# EAGLE design Project Canary V4.3 (EAGLE 8.4.1)
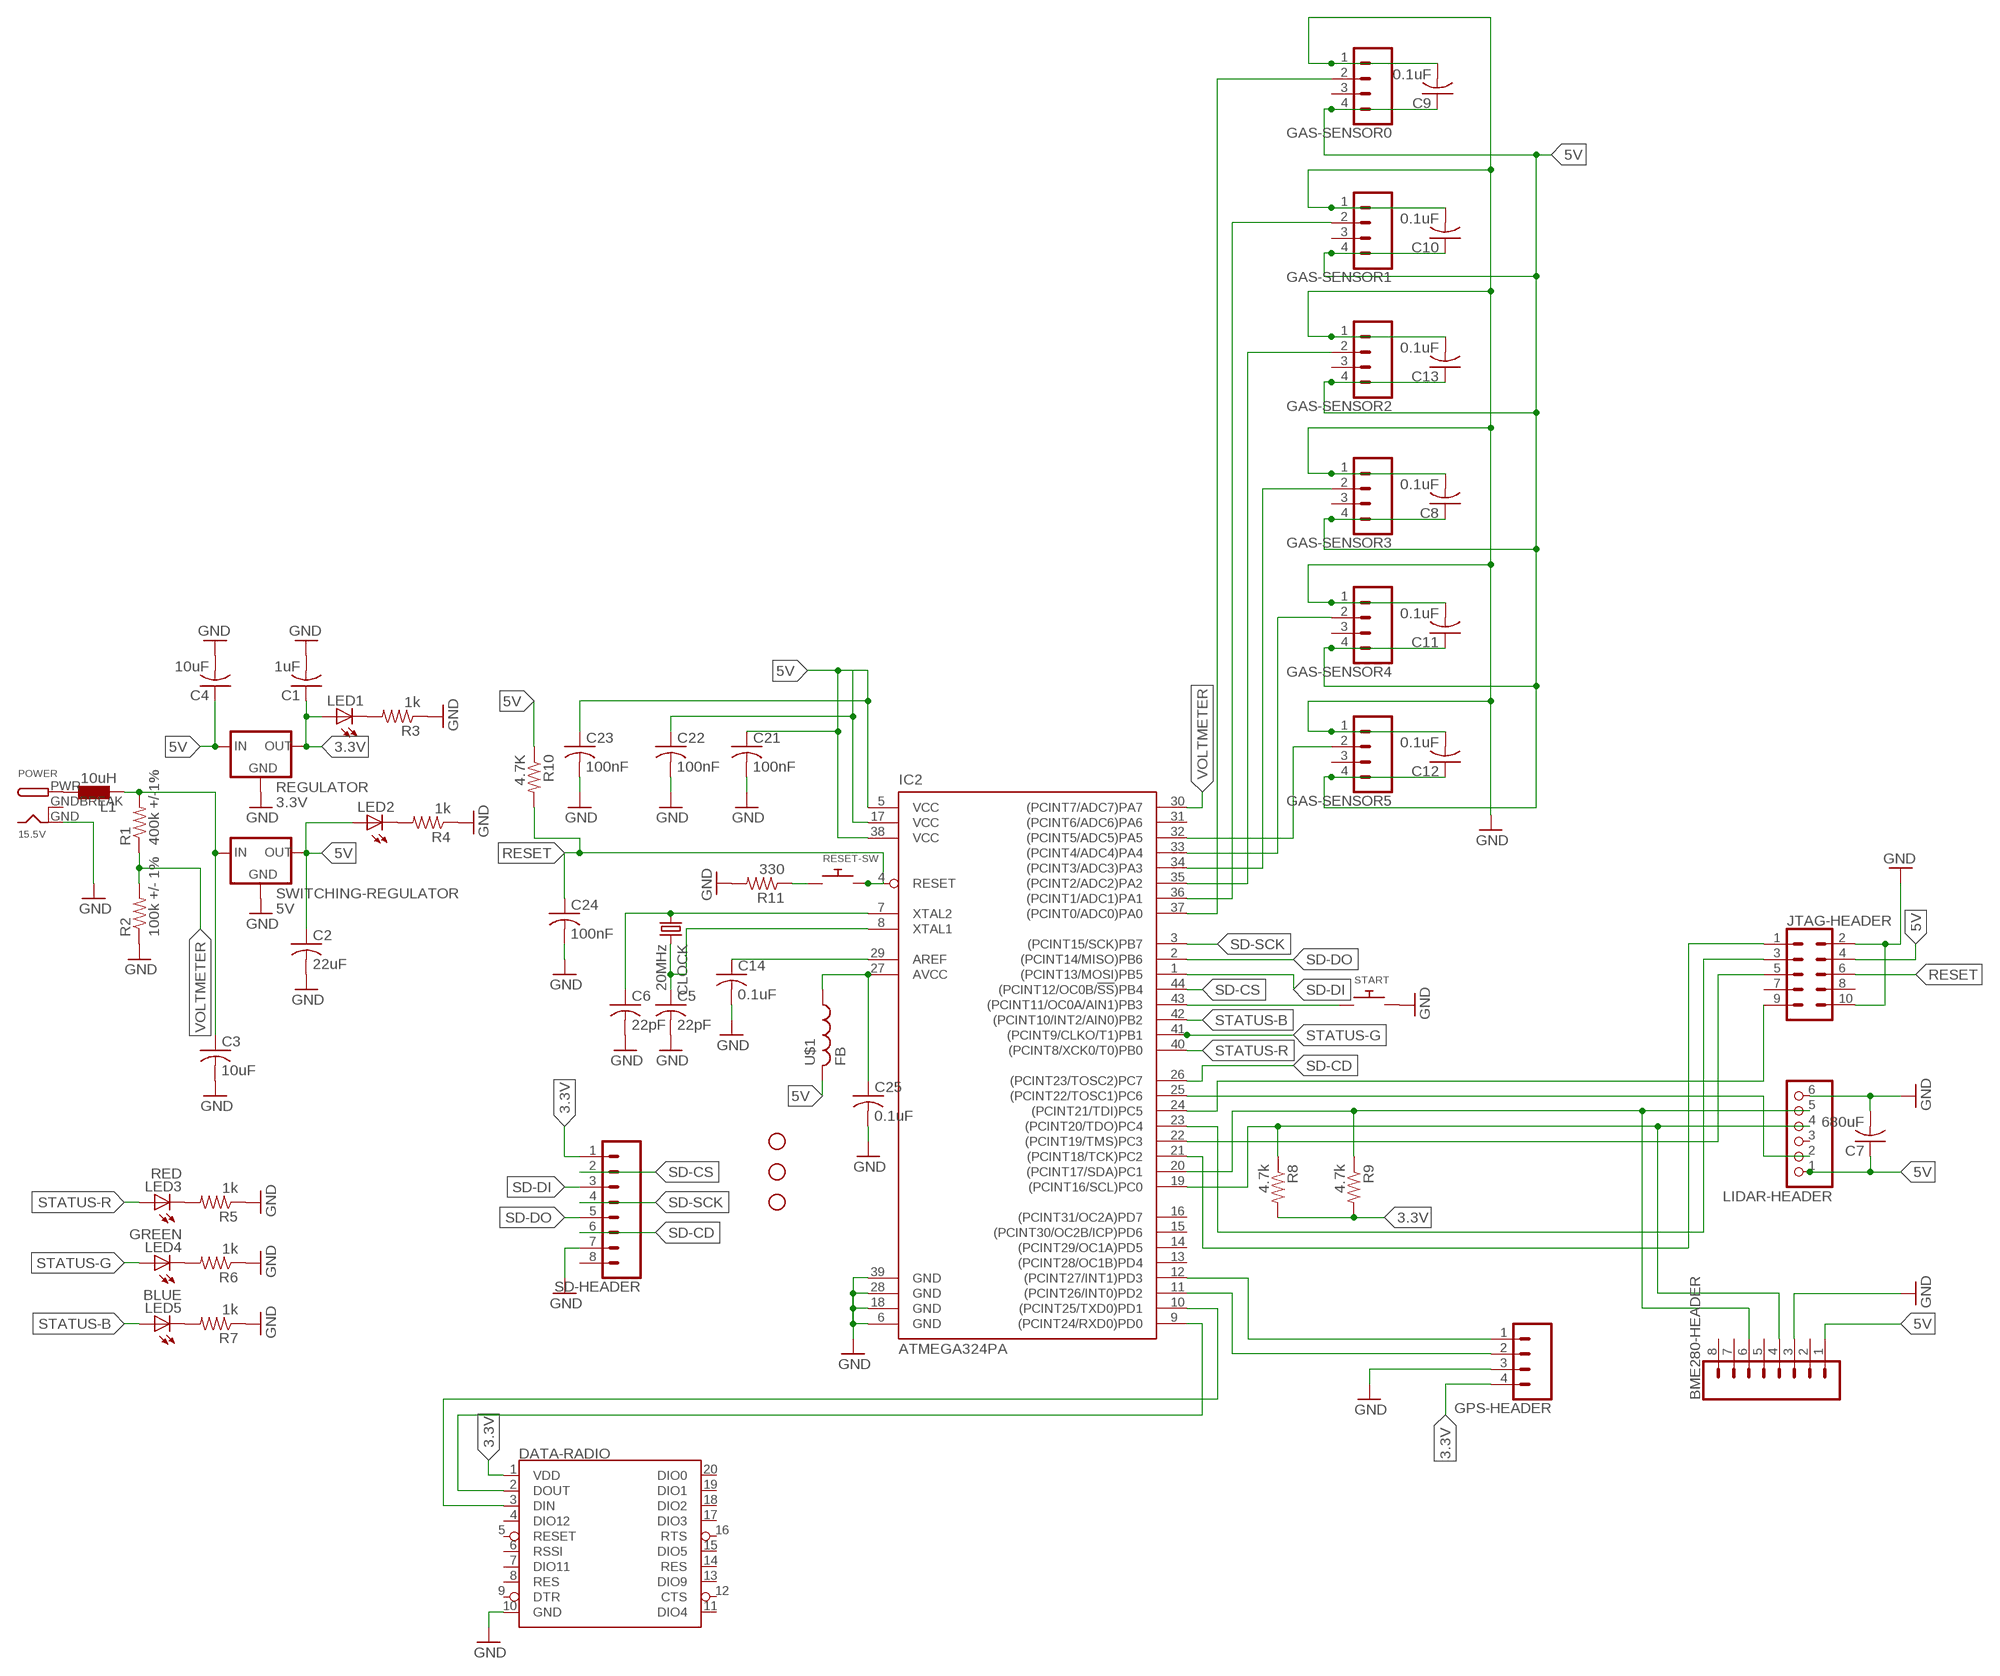
[diagram p0: schematic, sheet 1]

## Parts
BME280-HEADER  CONN_08"  [1X08]
C1  1uF  C-USC0805  [C0805]
C2  22uF  C-USC0603  [C0603]
C3  10uF  C-USC0805  [C0805]
C4  10uF  C-USC0603  [C0603]
C5  22pF  C-USC0603  [C0603]
C6  22pF  C-USC0603  [C0603]
C7  680uF  C-USC0603  [C0603]
C8  0.1uF  C-USC0603  [C0603]
C9  0.1uF  C-USC0603  [C0603]
C10  0.1uF  C-USC0603  [C0603]
C11  0.1uF  C-USC0603  [C0603]
C12  0.1uF  C-USC0603  [C0603]
C13  0.1uF  C-USC0603  [C0603]
C14  0.1uF  C-USC0603  [C0603]
C21  100nF  C-USC0603  [C0603]
C22  100nF  C-USC0603  [C0603]
C23  100nF  C-USC0603  [C0603]
C24  100nF  C-USC0805  [C0805]
C25  0.1uF  C-USC0603  [C0603]
CLOCK  20MHz  CRYSTAL68SMX  [86SMX]
DATA-RADIO  XBEE  [XBEE]
GAS-SENSOR0  CONN_04  [1X04]
GAS-SENSOR1  CONN_04  [1X04]
GAS-SENSOR2  CONN_04  [1X04]
GAS-SENSOR3  CONN_04  [1X04]
GAS-SENSOR4  CONN_04  [1X04]
GAS-SENSOR5  CONN_04  [1X04]
GPS-HEADER  CONN_04  [1X04]
IC2  ATMEGA324PA  ATMEGA644A  [TQFP44]
JTAG-HEADER  CONN_05X2PTH  [2X5]
L1  10uH  L  [L1812]
LED1  LEDCHIP-LED0805  [CHIP-LED0805]
LED2  LEDCHIP-LED0805  [CHIP-LED0805]
LED3  RED  LEDCHIP-LED0805  [CHIP-LED0805]
LED4  GREEN  LEDCHIP-LED0805  [CHIP-LED0805]
LED5  BLUE  LEDCHIP-LED0805  [CHIP-LED0805]
LIDAR-HEADER  PINHD-1X6  [1X06]
MOUNT-HOLE1  STAND-OFF  [STAND-OFF]
MOUNT-HOLE2  STAND-OFF  [STAND-OFF]
MOUNT-HOLE3  STAND-OFF  [STAND-OFF]
POWER  15.5V  DCBARRELPTH  [DCJACK_2MM_PTH]
R1  400k +/-1%  R-US_M0805  [M0805]
R2  100k +/- 1%  R-US_M0805  [M0805]
R3  1k  R-US_M0805  [M0805]
R4  1k  R-US_M0805  [M0805]
R5  1k  R-US_M0805  [M0805]
R6  1k  R-US_M0805  [M0805]
R7  1k  R-US_M0805  [M0805]
R8  4.7k  R-US_M0805  [M0805]
R9  4.7k  R-US_M0805  [M0805]
R10  4.7K  R-US_M0805  [M0805]
R11  330  R-US_M0805  [M0805]
REGULATOR  3.3V  V_REG_78XXSINK  [TO220-IGO]
RESET-SW  SWITCH_PUSHBUTTONSOFTTOUCHSMD_SJ  [PUSHBUTTON_SMD_SJ]
SD-HEADER  CONN_08"  [1X08]
START  SWITCH_PUSHBUTTONSOFTTOUCHSMD_SJ  [PUSHBUTTON_SMD_SJ]
SWITCHING-REGULATOR  5V  V_REG_78XXSINK  [TO220-IGO]
U$1  FB  [FB]

## Nets
3.3V: C1.1 DATA-RADIO.1(VDD) GPS-HEADER.4 LED1.A R8.2 R9.2 REGULATOR.OUT SD-HEADER.1
5V: BME280-HEADER.1 C2.1 C4.1 C7.1 C8.1 C9.1 C10.1 C11.1 C12.1 C13.1 C21.1 C22.1 C23.1 C25.1 GAS-SENSOR0.4 GAS-SENSOR1.4 GAS-SENSOR2.4 GAS-SENSOR3.4 GAS-SENSOR4.4 GAS-SENSOR5.4 IC2.5(VCC) IC2.17(VCC) IC2.27(AVCC) IC2.38(VCC) JTAG-HEADER.4 LED2.A LIDAR-HEADER.1 REGULATOR.IN SWITCHING-REGULATOR.OUT U$1.P$1
GND: BME280-HEADER.3 C1.2 C2.2 C3.2 C4.2 C5.2 C6.2 C7.2 C8.2 C9.2 C10.2 C11.2 C12.2 C13.2 C14.2 C21.2 C22.2 C23.2 C24.2 C25.2 DATA-RADIO.10(GND) GAS-SENSOR0.1 GAS-SENSOR1.1 GAS-SENSOR2.1 GAS-SENSOR3.1 GAS-SENSOR4.1 GAS-SENSOR5.1 GPS-HEADER.3 IC2.6(GND) IC2.18(GND) IC2.28(GND) IC2.39(GND) JTAG-HEADER.2 JTAG-HEADER.10 LIDAR-HEADER.6 POWER.GND R2.1 R3.1 R4.1 R5.1 R6.1 R7.1 R11.2 REGULATOR.GND SD-HEADER.7 START.P$2 SWITCHING-REGULATOR.GND
N$1: C3.1 L1.2 R1.2 SWITCHING-REGULATOR.IN
N$2: LED1.C R3.2
N$3: LED2.C R4.2
N$4: LED3.C R5.2
N$5: LED4.C R6.2
N$6: LED5.C R7.2
N$7: IC2.43((PCINT11/OC0A/AIN1)PB3) START.P$1
N$8: C6.1 CLOCK.1 IC2.7(XTAL2)
N$9: U$1.P$2
N$10: GPS-HEADER.1 IC2.12((PCINT27/INT1)PD3)
N$11: GPS-HEADER.2 IC2.11((PCINT26/INT0)PD2)
N$12: GAS-SENSOR0.2 IC2.37((PCINT0/ADC0)PA0)
N$13: IC2.25((PCINT22/TOSC1)PC6) LIDAR-HEADER.2
N$14: IC2.24((PCINT21/TDI)PC5) JTAG-HEADER.9
N$15: C14.1 IC2.29(AREF)
N$16: GAS-SENSOR1.2 IC2.36((PCINT1/ADC1)PA1)
N$17: GAS-SENSOR2.2 IC2.35((PCINT2/ADC2)PA2)
N$18: GAS-SENSOR3.2 IC2.34((PCINT3/ADC3)PA3)
N$19: GAS-SENSOR4.2 IC2.33((PCINT4/ADC4)PA4)
N$20: GAS-SENSOR5.2 IC2.32((PCINT5/ADC5)PA5)
N$21: BME280-HEADER.4 IC2.19((PCINT16/SCL)PC0) LIDAR-HEADER.4 R8.1
N$22: L1.1 POWER.PWR
N$23: IC2.23((PCINT20/TDO)PC4) JTAG-HEADER.3
N$24: BME280-HEADER.6 IC2.20((PCINT17/SDA)PC1) LIDAR-HEADER.5 R9.1
N$25: IC2.22((PCINT19/TMS)PC3) JTAG-HEADER.5
N$26: DATA-RADIO.3(DIN) IC2.10((PCINT25/TXD0)PD1)
N$27: DATA-RADIO.2(DOUT) IC2.9((PCINT24/RXD0)PD0)
N$28: IC2.21((PCINT18/TCK)PC2) JTAG-HEADER.1
N$30: R11.1 RESET-SW.P$1
N$31: R10.1
N$32: C5.1 CLOCK.4 IC2.8(XTAL1)
RESET: C24.1 IC2.4(RESET) JTAG-HEADER.6 R10.2 RESET-SW.P$2
SD-CD: IC2.26((PCINT23/TOSC2)PC7) SD-HEADER.6
SD-CS: IC2.44((PCINT12/OC0B/!SS!)PB4) SD-HEADER.2
SD-DI: IC2.1((PCINT13/MOSI)PB5) SD-HEADER.3
SD-DO: IC2.2((PCINT14/MISO)PB6) SD-HEADER.5
SD-SCK: IC2.3((PCINT15/SCK)PB7) SD-HEADER.4
STATUS-B: IC2.42((PCINT10/INT2/AIN0)PB2) LED5.A
STATUS-G: IC2.41((PCINT9/CLKO/T1)PB1) LED4.A
STATUS-R: IC2.40((PCINT8/XCK0/T0)PB0) LED3.A
VOLTMETER: IC2.30((PCINT7/ADC7)PA7) R1.1 R2.2
Unconnected: BME280-HEADER.2 BME280-HEADER.5 BME280-HEADER.7 BME280-HEADER.8 DATA-RADIO.4(DIO12) DATA-RADIO.5(RESET) DATA-RADIO.6(RSSI) DATA-RADIO.7(DIO11) DATA-RADIO.8(RES) DATA-RADIO.9(DTR) DATA-RADIO.11(DIO4) DATA-RADIO.12(CTS) DATA-RADIO.13(DIO9) DATA-RADIO.14(RES) DATA-RADIO.15(DIO5) DATA-RADIO.16(RTS) DATA-RADIO.17(DIO3) DATA-RADIO.18(DIO2) DATA-RADIO.19(DIO1) DATA-RADIO.20(DIO0) GAS-SENSOR0.3 GAS-SENSOR1.3 GAS-SENSOR2.3 GAS-SENSOR3.3 GAS-SENSOR4.3 GAS-SENSOR5.3 IC2.13((PCINT28/OC1B)PD4) IC2.14((PCINT29/OC1A)PD5) IC2.15((PCINT30/OC2B/ICP)PD6) IC2.16((PCINT31/OC2A)PD7) IC2.31((PCINT6/ADC6)PA6) JTAG-HEADER.7 JTAG-HEADER.8 LIDAR-HEADER.3 SD-HEADER.8

## Power pins joined to a net without a drawn wire
GNDBREAK: POWER.GNDBREAK

## Library data of the parts
BME280-HEADER SD-HEADER = SparkFun-Connectors:CONN_08: Multi connection point. Often used as Generic Header-pin footprint for 0.1 inch spaced/style header connections On any of the 0.1 inch spaced packages, you can populate with these: Break Away Headers - Straight <https://www.sparkfun.com/products/116> (PRT-00116) Break Away Male Headers - Right Angle <https://www.sparkfun.com/products/553> (PRT-00553) Female Headers <https://www.sparkfun.com/products/115> (PRT-00115) Break Away Headers - Machine Pin <https://www.sparkfun.com/products/117> (PRT-00117) Break Away Female Headers - Swiss Machine Pin <https://www.sparkfun.com/products/743> (PRT-00743) Arduino Stackable Header - 8 Pin <https://www.sparkfun.com/products/9279> (PRT-09279) For SCREWTERMINALS and SPRING TERMINALS visit here: Screw Terimnals on SparkFun.com <https://www.sparkfun.com/search/results?term=Screw+Terminals> (5mm/3.5mm/2.54mm spacing) This device is also useful as a general connection point to wire up your design to another part of your project. Our various solder wires solder well into these plated through hole pads. Hook-Up Wire - Assortment (Stranded, 22 AWG) <https://www.sparkfun.com/products/11375> (PRT-11375) Hook-Up Wire - Assortment (Solid Core, 22 AWG) <https://www.sparkfun.com/products/11367> (PRT-11367) View the entire wire category on our website here <https://www.sparkfun.com/categories/141> Special notes: Molex polarized connector foot print use with SKU : PRT-08231 with associated crimp pins and housings. 1MM SMD Version SKU: PRT-10208 NOTES ON THE VARIANTS LOCK and LOCK_LONGPADS... This footprint was designed to help hold the alignment of a through-hole component (i.e. 6-pin header) while soldering it into place. You may notice that each hole has been shifted either up or down by 0.005 of an inch from it's more standard position (which is a perfectly straight line). This slight alteration caused the pins (the squares in the middle) to touch the edges of the holes. Because they are alternating, it causes a "brace" to hold the component in place. 0.005 has proven to be the perfect amount of "off-center" position when using our standard breakaway headers. Although looks a little odd when you look at the bare footprint, once you have a header in there, the alteration is very hard to notice. Also,if you push a header all the way into place, it is covered up entirely on the bottom side.; PROD_ID: CONN-08438
C1-C14 C21-C25 = adafruit:C-US: CAPACITOR, American symbol
CLOCK = adafruit:CRYSTAL: CRYSTAL; OC_FARNELL: 6344860; OC_NEWARK: unknown
DATA-RADIO = SparkFun-RF:XBEE: Digi XBee and XBee Pro XBees are tiny blue chips that can communicate wirelessly with each other. They can do simple things, like replacing a couple of wires in serial communication, which is nice when you want to make a remote for your paintball vehicle. SparkFun Products SparkFun XBee Buying Guide <https://www.sparkfun.com/pages/xbee_guide> SparkFun XBee Explorer USB <https://www.sparkfun.com/products/11812> (WRL-11812) Breakout Board for XBee Module <https://www.sparkfun.com/products/8276> (WRL-8276) SparkFun XBee Explorer Regulated <https://www.sparkfun.com/products/11373> (WRL-11373) SparkFun XBee Explorer Dongle <https://www.sparkfun.com/products/11697> (WRL-11697) SparkFun XBee Shield <https://www.sparkfun.com/products/12847> (WRL-12847) SparkFun XBee Explorer Serial <https://www.sparkfun.com/products/13225> (WRL-13225)
GAS-SENSOR0 GAS-SENSOR1-GAS-SENSOR5 GPS-HEADER = SparkFun-Connectors:CONN_04: Multi connection point. Often used as Generic Header-pin footprint for 0.1 inch spaced/style header connections On any of the 0.1 inch spaced packages, you can populate with these: Break Away Headers - Straight <https://www.sparkfun.com/products/116> (PRT-00116) Break Away Male Headers - Right Angle <https://www.sparkfun.com/products/553> (PRT-00553) Female Headers <https://www.sparkfun.com/products/115> (PRT-00115) Break Away Headers - Machine Pin <https://www.sparkfun.com/products/117> (PRT-00117) Break Away Female Headers - Swiss Machine Pin <https://www.sparkfun.com/products/743> (PRT-00743) For SCREWTERMINALS and SPRING TERMINALS visit here: Screw Terimnals on SparkFun.com <https://www.sparkfun.com/search/results?term=Screw+Terminals> (5mm/3.5mm/2.54mm spacing) This device is also useful as a general connection point to wire up your design to another part of your project. Our various solder wires solder well into these plated through hole pads. Hook-Up Wire - Assortment (Stranded, 22 AWG) <https://www.sparkfun.com/products/11375> (PRT-11375) Hook-Up Wire - Assortment (Solid Core, 22 AWG) <https://www.sparkfun.com/products/11367> (PRT-11367) View the entire wire category on our website here <https://www.sparkfun.com/categories/141> Special notes: Molex polarized connector foot print use with SKU : PRT-08231 with associated crimp pins and housings. 1MM SMD Version SKU: PRT-10208; PROD_ID: CONN-09696
IC2 = atmel:ATMEGA644: 8-bit Microcontroller with 64K Bytes In-System Programmable Flash Source: http://www.atmel.com/dyn/resources/prod_documents/doc2593.pdf; MPN: ATMEGA644PV-10AU; OC_FARNELL: 1455123; OC_NEWARK: 58M3748
JTAG-HEADER = SparkFun-Connectors:CONN_05X2: Multi connection point. Often used as Generic Header-pin footprint for 0.1 inch spaced/style header connections For AVR SPI programming port, see special device with nice symbol: "AVR_SPI_PROG_5x2.dev" You can populate with any combo of single row headers, but if you'd like an exact match, check these: 2x5 AVR ICSP Male Header <https://www.sparkfun.com/products/778> (PRT-00778) 2x5 Pin Shrouded Header <https://www.sparkfun.com/products/8506> (PRT-08506) On any of the 0.1 inch spaced packages, you can populate with these: Break Away Headers - Straight <https://www.sparkfun.com/products/116> (PRT-00116) Break Away Male Headers - Right Angle <https://www.sparkfun.com/products/553> (PRT-00553) Female Headers <https://www.sparkfun.com/products/115> (PRT-00115) Break Away Headers - Machine Pin <https://www.sparkfun.com/products/117> (PRT-00117) Break Away Female Headers - Swiss Machine Pin <https://www.sparkfun.com/products/743> (PRT-00743) Special note: the shrouded connector mates well with our 5x2 ribbon cables: 2x5 Pin IDC Ribbon Cable <https://www.sparkfun.com/products/8535> (PRT-08535); PROD_ID: CONN-08499; SF_ID: PRT-0778
L1 = eagle-ltspice:L: INDUCTOR, European symbol; SPICEMODEL: NONE; SPICEPREFIX: L
LED1-LED5 = adafruit:LED: LED OSRAM: - CHIPLED LG R971, LG N971, LY N971, LG Q971, LY Q971, LO R971, LY R971 LH N974, LH R974 LS Q976, LO Q976, LY Q976 LO Q996 - Hyper CHIPLED LW Q18S LB Q993, LB Q99A, LB R99A - SideLED LS A670, LO A670, LY A670, LG A670, LP A670 LB A673, LV A673, LT A673, LW A673 LH A674 LY A675 LS A676, LA A676, LO A676, LY A676, LW A676 LS A679, LY A679, LG A679 - Hyper Micro SIDELED� LS Y876, LA Y876, LO Y876, LY Y876 LT Y87S - SmartLED LW L88C, LW L88S LB L89C, LB L89S, LG L890 LS L89K, LO L89K, LY L89K LS L896, LA L896, LO L896, LY L896 - TOPLED LS T670, LO T670, LY T670, LG T670, LP T670 LSG T670, LSP T670, LSY T670, LOP T670, LYG T670 LG T671, LOG T671, LSG T671 LB T673, LV T673, LT T673, LW T673 LH T674 LS T676, LA T676, LO T676, LY T676, LB T676, LH T676, LSB T676, LW T676 LB T67C, LV T67C, LT T67C, LS T67K, LO T67K, LY T67K, LW E67C LS E67B, LA E67B, LO E67B, LY E67B, LB E67C, LV E67C, LT E67C LW T67C LS T679, LY T679, LG T679 LS T770, LO T770, LY T770, LG T770, LP T770 LB T773, LV T773, LT T773, LW T773 LH T774 LS E675, LA E675, LY E675, LS T675 LS T776, LA T776, LO T776, LY T776, LB T776 LHGB T686 LT T68C, LB T68C - Hyper Mini TOPLED� LB M676 - Mini TOPLED Santana� LG M470 LS M47K, LO M47K, LY M47K Source: http://www.osram.convergy.de/
LIDAR-HEADER = adafruit:PINHD-1X6: PIN HEADER
MOUNT-HOLE1-MOUNT-HOLE3 = SparkFun-Hardware:STAND-OFF: Stand Off Drill holes for mechanically mounting via screws, standoffs, etc. Note: Use the keepout ring to avoid running the screw head into surrounding components. Variant Overviews STAND-OFF - Mechanical footprint for a #4 phillips button head screw. STAND-OFF-TIGHT - Mechanical footprint for a #4 phillips button head screw, Example SparkFun Products Screw - Phillips Head (1/4", 4-40, 10 pack) <https://www.sparkfun.com/products/10453> (PRT-10453) Screw - Phillips Head (1/2", 4-40, 10 pack) <https://www.sparkfun.com/products/10452> (PRT-10452) Screw - Phillips Head (3/4", 4-40, 10 pack) <https://www.sparkfun.com/products/10451> (PRT-10451) Screw - Phillips Head (1", 4-40, 10 pack) <https://www.sparkfun.com/products/10450> (PRT-10450)
POWER = adafruit:DCBARREL: 2.0mm DC Barrel Jack DCJACK_2MM_PTH - Through Hole Jack (4UConnector: 05537)
R1-R11 = adafruit:R-US_: RESISTOR, American symbol
REGULATOR SWITCHING-REGULATOR = SparkFun-IC-Power:V_REG_78XX: Voltage Regulator Standard 78xx regulator. IGO (Input Ground Output). Spark Fun Electronics SKU : COM-00107
RESET-SW START = adafruit:SWITCH_PUSHBUTTON: Buttons SOFTTOUCHSMD_SJ - Soft touch temporary push button (Super Junk Akihabara) Compatible with SKPMANE010 [Mouser: 688-SKPMAN] C&K_KSS = Digikey: KSS221GLFS
U$1 = adafruit:FB: Ferrite bead Digikey #P9821BK-ND

## Net classes
0 5V: width 0.508 mm
1 3.3V: width 0.508 mm

## Board
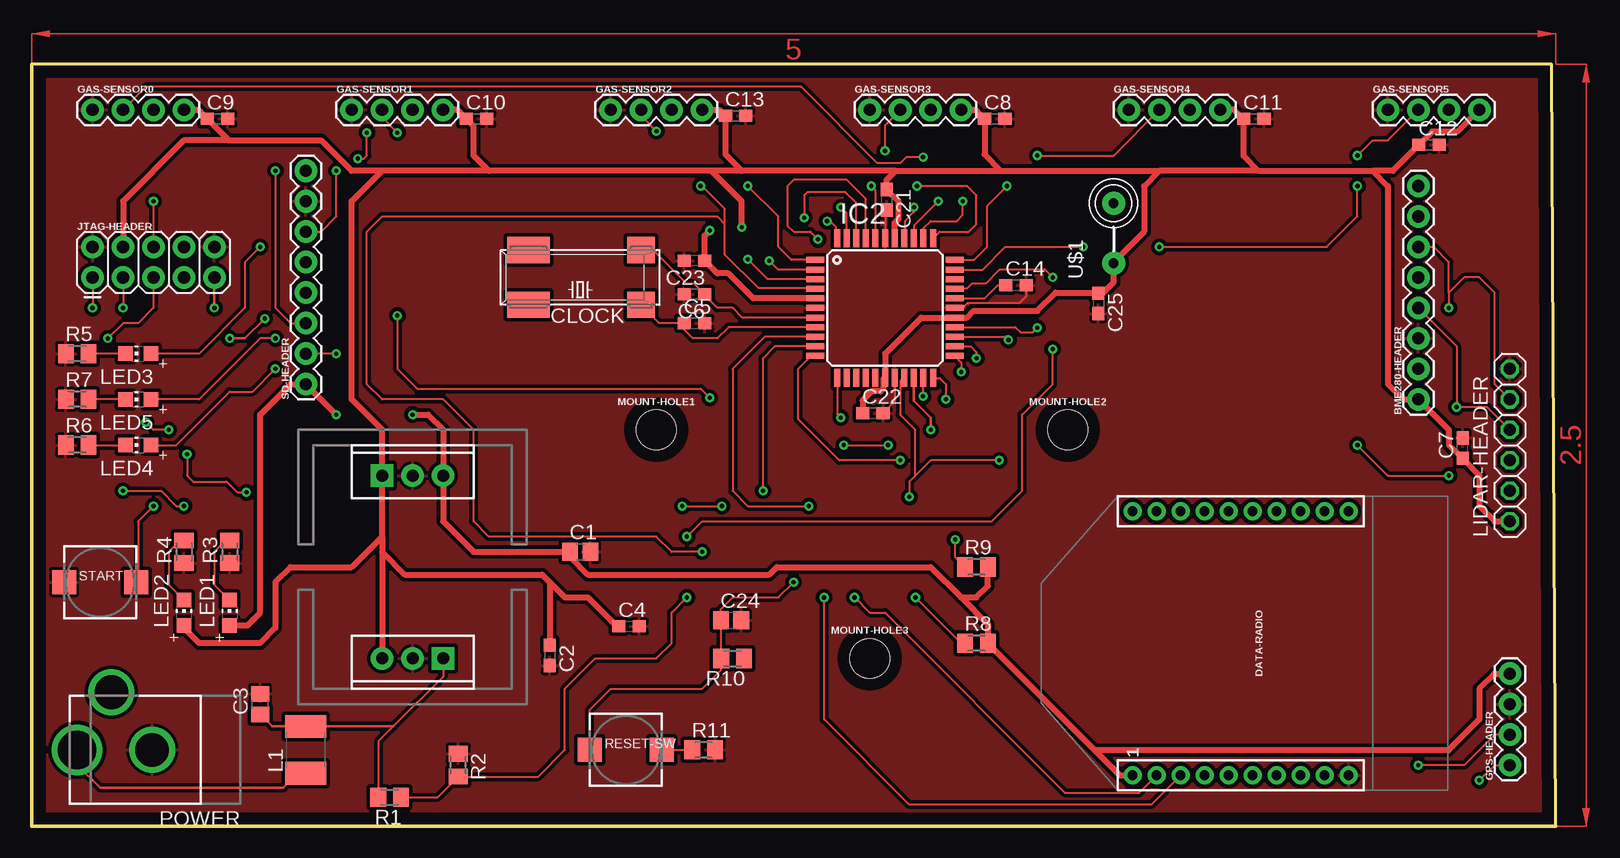
[diagram p1: board, top side]
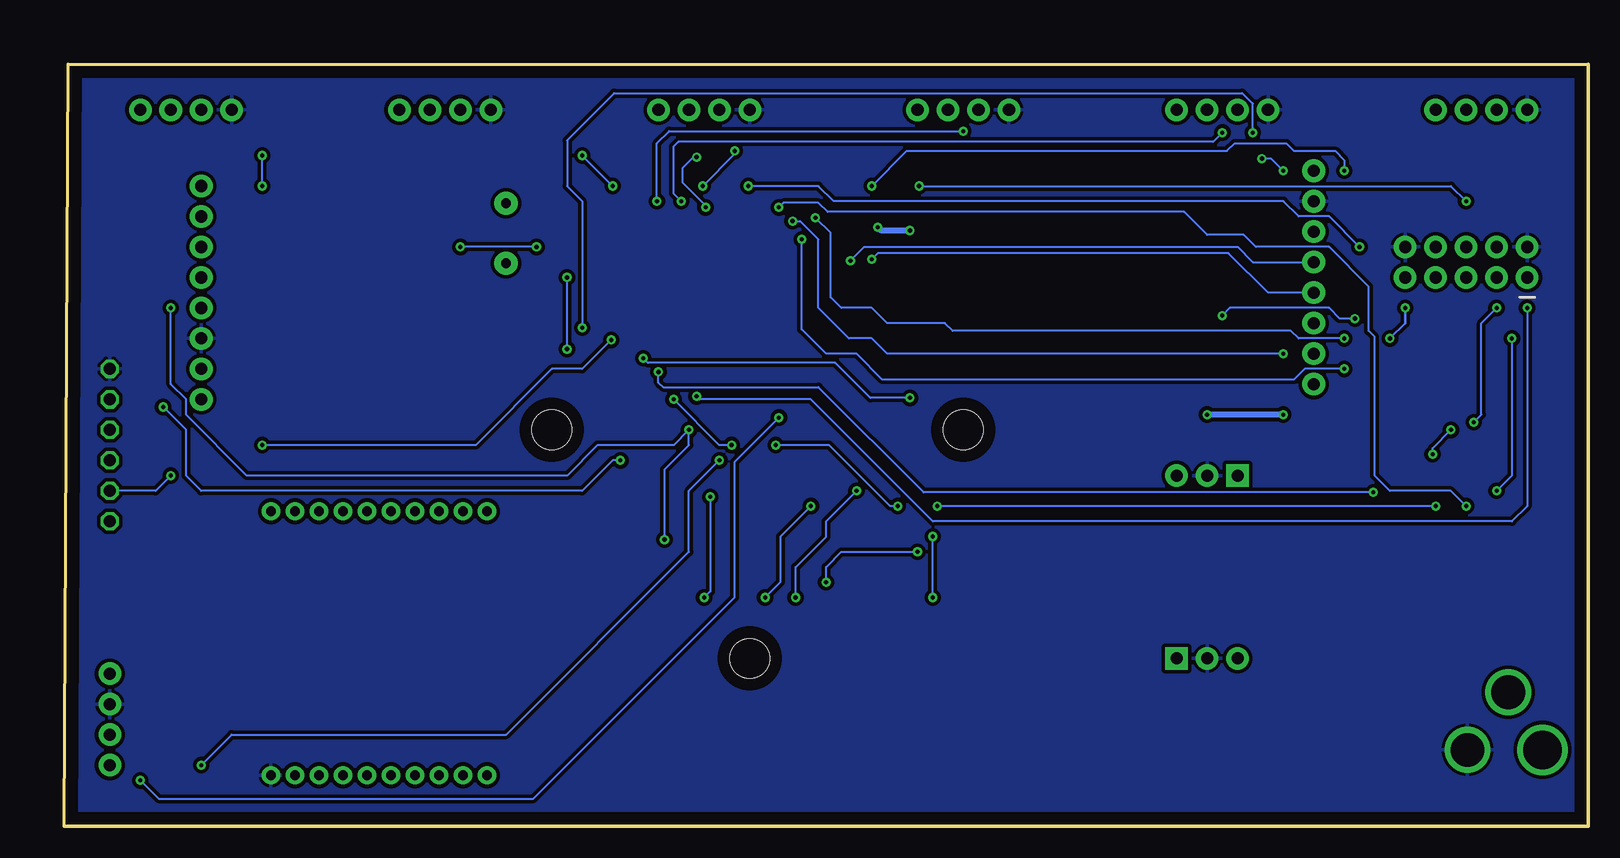
[diagram p2: board, bottom side, seen from below]

Size 127 x 63.5 mm. Coordinates in mm from the lower left corner, seen from the top.
Outline: 0,0 127,0 126.67,63.49 0,63.5 0,0
Copper layers (1*16): Top 0.035mm / dielectric 1.5mm / Bottom 0.035mm
Design rules "default": minimum track width 6mil, minimum drill 0.35mm, track to track 6mil, track to pad 6mil, pad to pad 6mil, via to via 6mil, smd to smd 6mil, copper to edge 40mil, drill to drill 6mil, minimum pad ring 10mil, minimum via ring 8mil, stop-mask expansion 4mil, vias tented up to drill 0mil, thermal gap 10mil

### Footprints (pad centres in the part's own frame; a part is rotated, then mirrored left to right if it is on the bottom)
1X08 = drill 1.016 pad 1.88: 1 0,0; 2 2.54,0; 3 5.08,0; 4 7.62,0; 5 10.16,0; 6 12.7,0; 7 15.24,0; 8 17.78,0
C0805 = smd 1.3 x 1.5: 1 -0.85,0; 2 0.85,0
C0603 = smd 1.1 x 1: 1 -0.85,0; 2 0.85,0
86SMX = smd 2.286 x 2.184: 1 -5.08,-2.286; 4 -5.08,2.286 | smd 3.556 x 2.184: 2 4.318,-2.286; 3 4.318,2.286
XBEE = drill 0.8 pad 1.524: 1 -11,20; 2 -11,18; 3 -11,16; 4 -11,14; 5 -11,12; 6 -11,10; 7 -11,8; 8 -11,6; 9 -11,4; 10 -11,2; 11 11,2; 12 11,4; 13 11,6; 14 11,8; 15 11,10; 16 11,12; 17 11,14; 18 11,16; 19 11,18; 20 11,20
1X04 = drill 1.016 pad 1.88: 1 0,0; 2 2.54,0; 3 5.08,0; 4 7.62,0
TQFP44 = smd 1.5 x 0.5: 1 -5.8,4; 2 -5.8,3.2; 3 -5.8,2.4; 4 -5.8,1.6; 5 -5.8,0.8; 6 -5.8,0; 7 -5.8,-0.8; 8 -5.8,-1.6; 9 -5.8,-2.4; 10 -5.8,-3.2; 11 -5.8,-4; 23 5.8,-4; 24 5.8,-3.2; 25 5.8,-2.4; 26 5.8,-1.6; 27 5.8,-0.8; 28 5.8,0; 29 5.8,0.8; 30 5.8,1.6; 31 5.8,2.4; 32 5.8,3.2; 33 5.8,4 | smd 0.5 x 1.5: 12 -4,-5.8; 13 -3.2,-5.8; 14 -2.4,-5.8; 15 -1.6,-5.8; 16 -0.8,-5.8; 17 0,-5.8; 18 0.8,-5.8; 19 1.6,-5.8; 20 2.4,-5.8; 21 3.2,-5.8; 22 4,-5.8; 34 4,5.8; 35 3.2,5.8; 36 2.4,5.8; 37 1.6,5.8; 38 0.8,5.8; 39 0,5.8; 40 -0.8,5.8; 41 -1.6,5.8; 42 -2.4,5.8; 43 -3.2,5.8; 44 -4,5.8
2X5 = drill 1.016 pad 1.88: 1 0,0; 2 0,2.54; 3 2.54,0; 4 2.54,2.54; 5 5.08,0; 6 5.08,2.54; 7 7.62,0; 8 7.62,2.54; 9 10.16,0; 10 10.16,2.54
L1812 = smd 1.9 x 3.4: 1 -1.95,0; 2 1.95,0
CHIP-LED0805 = smd 1.2 x 1.2: A 0,-1.05; C 0,1.05
1X06 = drill 1.016 octagon: 1 -6.35,0; 2 -3.81,0; 3 -1.27,0; 4 1.27,0; 5 3.81,0; 6 6.35,0
STAND-OFF = hole 3.302: 0,0
DCJACK_2MM_PTH = drill 2.8: GND 0,7.35; GNDBREAK 4.8,10.75 | drill 3.2: PWR 0,13.6
M0805 = smd 1.3 x 1.6: 1 -0.95,0; 2 0.95,0
TO220-IGO = drill 1 pad 1.88: GND 0,0; OUT 2.54,0 | drill 1 pad 1.88 square: IN -2.54,0
PUSHBUTTON_SMD_SJ = smd 2 x 2: P$1 3,0; P$2 -3,0
FB = drill 0.8 pad 1.93: P$1 -2.5,0; P$2 2.5,0

### Placement (x,y rotation side)
BME280-HEADER  115.57,35.56 90 top
C1  45.72,22.86 0 top
C2  43.18,14.22 270 top
C3  19.05,10.16 90 top
C4  49.78,16.64 0 top
C5  55.24,41.91 0 top
C6  55.24,44.32 180 top
C7  119.25,31.5 90 top
C8  80.26,58.93 0 top
C9  15.49,58.93 0 top
C10  37.08,58.93 0 top
C11  101.85,58.93 0 top
C12  116.46,56.77 0 top
C13  58.67,59.18 0 top
C14  82.04,45.09 0 top
C21  71.25,52.2 270 top
C22  70.1,34.42 0 top
C23  55.24,47.12 180 top
C24  58.29,17.14 0 top
C25  88.9,43.56 270 top
CLOCK  45.72,45.72 180 top
DATA-RADIO  111.76,15.24 90 top
GAS-SENSOR0  5.08,59.69 0 top
GAS-SENSOR1  26.67,59.69 0 top
GAS-SENSOR2  48.26,59.69 0 top
GAS-SENSOR3  69.85,59.69 0 top
GAS-SENSOR4  91.44,59.69 0 top
GAS-SENSOR5  113.03,59.69 0 top
GPS-HEADER  123.19,5.08 90 top
IC2  71.12,43.18 0 top
JTAG-HEADER  5.08,45.72 0 top
L1  22.86,6.35 90 top
LED1  16.51,17.78 0 top
LED2  12.7,17.78 0 top
LED3  8.89,39.37 90 top
LED4  8.89,31.75 90 top
LED5  8.89,35.56 90 top
LIDAR-HEADER  123.19,31.75 90 top
MOUNT-HOLE1  52.07,33.02 0 top
MOUNT-HOLE2  86.36,33.02 0 top
MOUNT-HOLE3  69.85,13.97 0 top
POWER  17.4,6.35 90 top
R1  29.84,2.41 180 top
R2  35.56,5.08 270 top
R3  16.51,22.86 90 top
R4  12.7,22.86 90 top
R5  3.81,39.37 0 top
R6  3.81,31.75 0 top
R7  3.81,35.56 0 top
R8  78.74,15.24 0 top
R9  78.74,21.59 0 top
R10  58.42,13.97 180 top
R11  56.01,6.35 0 top
REGULATOR  31.75,29.21 0 top
RESET-SW  49.53,6.35 0 top
SD-HEADER  22.86,36.83 90 top
START  5.71,20.32 0 top
SWITCHING-REGULATOR  31.75,13.97 180 top
U$1  90.17,49.4 90 top

### Tracks (layer width: path | path; a pad name or v marks a point on that pad's centre or on a via)
3.3V  (via drill 0.35)
  Top 0.508: LED1.A 18,16.73 19.05,17.78 19.05,34.29 21.59,36.83 SD-HEADER.1 v25.4,34.29 | v31.75,34.29 33.02,34.29 34.29,33.02 REGULATOR.OUT 34.29,25.4 36.83,22.86 C1.1 44.87,22.44 46.35,20.95 61.47,20.95 62.1,21.59 74.93,21.59 77.47,19.05 | 77.47,19.05 78.74,19.05 79.69,20 R9.2 | 77.47,19.05 79.69,16.83 R8.2 88.61,6.32 | GPS-HEADER.4 121.92,12.7 120.65,11.43 120.65,8.89 118.08,6.32 88.61,6.32 | 88.61,6.32 90.69,4.24 DATA-RADIO.1
  Bottom 0.508: v25.4,34.29 v31.75,34.29
5V  (via drill 0.35)
  Top 0.508: 38.1,54.61 29.21,54.61 | 56.64,54.61 38.1,54.61 | 59.18,54.61 56.64,54.61 | 29.21,54.61 26.67,54.61 24.13,57.15 16.42,57.15 | 16.42,57.15 12.7,57.15 7.62,52.07 JTAG-HEADER.4 | LIDAR-HEADER.1 121.92,25.4 120.65,26.67 120.65,29.25 C7.1 119.21,30.65 118.11,31.75 118.11,33.02 BME280-HEADER.1 114.3,35.56 113.03,36.83 113.03,53.34 111.76,54.61 | LED2.A 12.7,16.51 13.97,15.24 19.05,15.24 20.32,16.51 20.32,20.32 21.59,21.59 26.67,21.59 29.21,24.13 | 43.18,20.32 44.45,19.05 46.35,19.05 48.77,16.64 C4.1 | 43.18,20.32 42.55,20.95 31.11,20.95 29.21,22.86 | 72.01,54.61 80.77,54.61 | 72.01,54.61 59.18,54.61 | 80.77,54.61 93.98,54.61 | 102.23,54.61 93.98,54.61 | 102.23,54.61 111.76,54.61 | 111.76,54.61 113.45,54.61 C12.1 116.72,57.88 118.84,57.88 GAS-SENSOR5.4 | 93.98,54.61 92.71,53.34 92.71,49.53 90.17,46.99 U$1.P$1 90.17,45.3 89.28,44.41 C25.1 88.86,44.45 85.34,44.45 83.82,42.93 78.49,42.93 77.94,42.38 IC2.27 74.13,42.38 71.12,39.37 IC2.17 70.98,37.24 70.98,36.46 70.74,36.22 70.01,36.22 69.25,35.47 C22.1 | 29.21,24.13 29.21,22.86 | 29.21,22.86 SWITCHING-REGULATOR.OUT | 29.21,24.13 REGULATOR.IN 29.21,33.02 26.67,35.56 26.67,52.07 29.21,54.61 | IC2.5 60.16,43.98 58.08,46.06 57.15,46.06 C23.1 56.09,49.21 v56.52,49.63 | GAS-SENSOR1.4 35.47,59.69 C10.1 36.83,58.33 36.83,55.88 38.1,54.61 | 59.18,54.61 57.82,55.97 C13.1 | v59.18,49.91 59.18,52.07 56.64,54.61 | GAS-SENSOR3.4 78.65,59.69 C8.1 79.41,55.97 80.77,54.61 | 102.23,54.61 101,55.84 C11.1 100.24,59.69 GAS-SENSOR4.4 | IC2.38 71.92,50.27 72.26,50.61 72.26,52.07 71.29,53.05 C21.1 | 57.57,59.18 C13.1 | C13.1 57.32,59.69 GAS-SENSOR2.4
  Top 0.508: GAS-SENSOR0.4 13.88,59.69 C9.1 16.42,57.15 | 71.41,52.92 C21.1 | C21.1 71.25,53.85 72.01,54.61 | 43.18,20.32 C2.1
  Bottom 0.508: v56.52,49.63 58.9,49.63 v59.18,49.91
GND
  Top 0.152: IC2.18 71.92,35.38 C22.2 | C21.2 71.12,51.22 IC2.39 | C14.2 82.89,44.23 82.93,44.2 82.3,43.56 77.98,43.56 77.6,43.18 IC2.28
  pour Top (isolate 0.305): 0,0 0,63.5 127,63.5 127,0
  pour Top (isolate 0.305): 0,0 127,0 127,63.5 0,63.5
  pour Bottom (isolate 0.305): 0,0 0,63.5 127,63.5 127,0
N$1
  Top 0.152: SWITCHING-REGULATOR.IN 34.29,12.45 30.14,8.3 28.89,7.05 R1.2
  Top 0.2: C3.1 20.06,8.3 L1.2 30.14,8.3
N$2
  Top 0.152: R3.2 16.19,23.81 15.24,22.86 15.24,20.1 LED1.C
N$3
  Top 0.152: R4.2 12.38,23.81 11.43,22.86 11.43,20.1 LED2.C
N$4
  Top 0.152: LED3.C R5.2
N$5
  Top 0.152: R6.2 LED4.C
N$6
  Top 0.152: LED5.C R7.2
N$7  (via drill 0.35)
  Top 0.152: IC2.43 67.92,51.08 v67.44,51.56 | v10.16,26.67 8.89,25.4 8.89,20.5 START.P$1
  Bottom 0.152: v10.16,26.67 11.43,27.94 16.51,27.94 17.78,29.21 17.78,40.77 18.29,41.27 18.29,44.96 21.59,48.26 27.69,48.26 28.7,49.28 31.75,49.28 33.66,51.18 63.37,51.18 64.14,51.94 67.06,51.94 v67.44,51.56
N$8
  Top 0.152: IC2.7 59.22,42.38 58.42,43.18 57.15,43.18 56.09,44.23 C6.1 55.21,45.21 54.61,45.21 51.82,48.01 CLOCK.1
N$10  (via drill 0.35)
  Top 0.152: IC2.12 67.12,34.35 v67.44,34.04 | v120.65,3.81 121.92,5.08 GPS-HEADER.1
  Bottom 0.152: v120.65,3.81 119.13,2.29 87.88,2.29 71.12,19.05 71.12,30.35 v67.44,34.04
N$11  (via drill 0.35)
  Top 0.152: GPS-HEADER.2 121.92,7.62 119.38,5.08 v115.57,5.08 | v72.39,30.48 67.31,30.48 63.88,33.91 63.88,38.1 64.96,39.18 IC2.11
  Bottom 0.152: v115.57,5.08 113.03,7.62 90.17,7.62 74.93,22.86 74.93,27.94 v72.39,30.48
N$12  (via drill 0.35)
  Top 0.152: v73.53,51.56 73.53,51.18 72.77,50.42 72.77,49.03 IC2.37 | v74.3,55.75 72.9,55.75 72.39,55.24 70.48,55.24 64.14,61.59 9.53,61.59 GAS-SENSOR0.2
  Bottom 0.152: v73.53,51.56 73.53,51.69 75.44,53.59 75.44,54.86 74.55,55.75 v74.3,55.75
N$13  (via drill 0.35)
  Top 0.152: IC2.25 81.14,40.78 v81.41,40.51 | v110.49,31.75 113.03,29.21 v118.11,29.21
  Bottom 0.152: v81.41,40.51 83.82,38.1 86.36,38.1 92.71,31.75 v110.49,31.75 | v118.11,29.21 119.38,27.94 LIDAR-HEADER.2
N$14  (via drill 0.35)
  Top 0.152: IC2.24 78.26,39.98 78.74,39.5 v78.74,38.99 | v30.48,42.55 30.48,38.1 32.13,36.45 55.75,36.45 v56.52,35.69
  Top 0.2: v19.43,42.29 17.78,40.64 v16.51,40.64 | v15.24,43.18 JTAG-HEADER.9
  Bottom 0.152: v19.43,42.29 20.7,42.29 21.59,43.18 29.84,43.18 v30.48,42.55 | v56.52,35.69 59.82,35.69 62.74,38.61 78.36,38.61 v78.74,38.99
  Bottom 0.2: v16.51,40.64 15.24,41.91 v15.24,43.18
N$15
  Top 0.152: IC2.29 79.41,43.98 80.52,45.09 C14.1
N$16  (via drill 0.35)
  Top 0.152: v30.48,57.78 29.21,59.05 GAS-SENSOR1.2 | v75.56,52.07 73.52,50.02 IC2.36
  Bottom 0.152: v75.56,52.07 76.2,52.7 76.2,56.64 75.82,57.02 31.24,57.02 v30.48,57.78
N$17  (via drill 0.35)
  Top 0.152: IC2.35 74.32,49.81 74.93,50.42 77.09,50.42 77.6,50.93 v77.6,52.07 | v52.07,57.91 50.8,59.18 GAS-SENSOR2.2
  Bottom 0.152: v77.6,52.07 77.6,56.9 76.58,57.91 v52.07,57.91
N$18  (via drill 0.35)
  Top 0.152: IC2.34 75.67,49.53 78.11,49.53 78.74,50.16 78.74,52.58 77.98,53.34 v73.79,53.34 | v71.12,56.26 71.12,58.42 GAS-SENSOR3.2
  Bottom 0.152: v73.79,53.34 71.12,56.01 v71.12,56.26
N$19  (via drill 0.35)
  Top 0.152: IC2.33 78.55,47.18 79.63,48.26 79.63,51.69 v81.28,53.34 | v83.82,55.88 90.17,55.88 GAS-SENSOR4.2
  Bottom 0.152: v81.28,53.34 v83.82,55.88
N$20  (via drill 0.35)
  Top 0.152: IC2.32 79.27,46.38 81.15,48.26 v87.63,48.26 | v93.98,48.26 107.95,48.26 110.49,50.8 v110.49,53.34 | v110.49,55.88 111.76,57.15 113.03,57.15 GAS-SENSOR5.2
  Bottom 0.152: v87.63,48.26 v93.98,48.26 | v110.49,53.34 v110.49,55.88
N$21  (via drill 0.35)
  Top 0.152: IC2.19 72.4,37.06 72.4,36.53 72.39,36.53 72.39,34.29 73.66,33.02 73.66,29.21 | 73.66,29.21 73.15,28.7 v73.15,27.43 | v80.64,30.48 74.93,30.48 73.66,29.21 | v73.66,19.05 77.47,15.24 R8.1 | LIDAR-HEADER.4 121.28,34.92 v118.75,34.92 118.75,40.01 BME280-HEADER.4
  Bottom 0.152: v73.15,27.43 73.15,19.56 v73.66,19.05 | v80.64,30.48 81.28,30.48 83.82,27.94 115.57,27.94 116.84,29.21 116.84,33.02 v118.75,34.92
N$22
  Top 0.2: POWER.PWR 3.81,5.08 5.71,3.17 20.95,3.17 22.23,4.45 22.82,4.45 L1.1
N$23  (via drill 0.35)
  Top 0.152: IC2.23 77.47,38.63 v77.47,37.85 | v12.95,30.99 12.95,29.21 13.46,28.7 16.26,28.7 17.14,27.81 v17.91,27.81 | v11.43,33.02 10.16,33.02 v9.53,33.66 | JTAG-HEADER.3 v7.62,43.18
  Bottom 0.152: v17.91,27.81 55.37,27.81 64.14,36.58 77.09,36.58 77.47,36.96 v77.47,37.85 | v12.95,30.99 12.95,31.5 v11.43,33.02 | v9.53,33.66 8.89,34.29 8.89,41.91 v7.62,43.18
N$24  (via drill 0.35)
  Top 0.152: R9.1 76.96,22.42 v76.96,23.88 | BME280-HEADER.6 116.84,48.26 118.11,46.99 118.11,44.45 | 118.11,44.45 v118.11,43.18 | LIDAR-HEADER.5 121.92,36.83 121.92,44.45 120.65,45.72 119.38,45.72 118.11,44.45
  Top 0.2: IC2.20 73.52,35.45 74.93,34.04 v74.93,33.02
  Bottom 0.152: v76.96,23.88 76.96,29.72 74.93,31.75 v74.93,33.02 76.2,31.75 82.55,31.75 85.09,29.21 111.76,29.21 116.84,34.29 116.84,35.56 118.11,36.83 v118.11,43.18
N$25  (via drill 0.35)
  Top 0.152: JTAG-HEADER.5 10.16,43.18 8.89,41.91 7.62,41.91 v6.35,40.64 | v12.7,26.67 12.06,26.67 10.79,27.94 v7.62,27.94 | v54.23,26.67 v57.53,26.67 | v67.69,31.75 v71.37,31.75 | IC2.22 75.16,37.34 75.69,37.34 76.2,36.83 v76.2,35.56
  Bottom 0.152: v6.35,40.64 6.35,29.21 v7.62,27.94 | v12.7,26.67 v54.23,26.67 | v57.53,26.67 58.17,26.67 63.25,31.75 v67.69,31.75 | v71.37,31.75 72.39,31.75 v76.2,35.56
N$26  (via drill 0.35)
  Top 0.152: DATA-RADIO.3 93.3,1.78 73.15,1.78 66.04,8.89 v66.04,19.05 | 65.22,39.88 IC2.10 61.95,39.98 60.96,38.99 v60.96,27.94
  Bottom 0.152: v66.04,19.05 66.04,21.59 63.5,24.13 63.5,25.4 v60.96,27.94
N$27  (via drill 0.35)
  Top 0.152: IC2.9 61.1,40.78 58.42,38.1 58.42,27.94 59.69,26.67 v64.77,26.67 | v68.58,19.05 69.85,17.78 71.12,17.78 86.11,2.79 92.31,2.79 DATA-RADIO.2
  Bottom 0.152: v64.77,26.67 67.31,24.13 67.31,20.32 v68.58,19.05
N$28  (via drill 0.35)
  Top 0.152: JTAG-HEADER.1 v5.08,43.18 | v74.3,35.81 74.3,37.35 IC2.21
  Bottom 0.152: v5.08,43.18 5.08,26.67 6.35,25.4 54.61,25.4 64.77,35.56 74.04,35.56 v74.3,35.81
N$30
  Top 0.152: RESET-SW.P$1 R11.1
N$32
  Top 0.152: IC2.8 58.09,41.58 57.15,40.64 55.12,40.64 54.4,41.36 C5.1 52.32,41.91 CLOCK.4
RESET  (via drill 0.35)
  Top 0.152: RESET-SW.P$2 46.53,9.7 48.26,11.43 55.88,11.43 57.47,13.02 R10.2 57.47,17.12 C24.1 57.44,18.07 58.42,19.05 62.23,19.05 v63.5,20.32 | v55.88,22.86 53.34,22.86 52.07,24.13 38.1,24.13 36.83,25.4 36.83,33.02 34.29,35.56 29.21,35.56 27.94,36.83 27.94,49.53 29.21,50.8 57.15,50.8 57.78,50.16 | IC2.4 65.27,44.83 60.58,44.83 57.78,47.62 57.78,50.16 | 57.78,50.16 57.78,51.44 55.88,53.34 v55.75,53.34 | v10.16,52.07 JTAG-HEADER.6
  Bottom 0.152: v63.5,20.32 63.5,21.59 62.23,22.86 v55.88,22.86 | v55.75,53.34 11.43,53.34 v10.16,52.07
SD-CD  (via drill 0.35)
  Top 0.152: SD-HEADER.6 24.13,49.53 25.4,50.8 v25.4,54.61 | v27.18,55.63 27.69,55.63 27.94,55.88 v27.94,57.78 | IC2.26 81.99,41.58 82.42,41.15 83.44,41.15 v83.82,41.53
  Bottom 0.152: v25.4,54.61 26.42,55.63 v27.18,55.63 | v27.94,57.78 27.94,60.2 28.83,61.09 81.15,61.09 85.09,57.15 85.09,53.34 83.82,52.07 v83.82,41.53
SD-CS  (via drill 0.35)
  Top 0.152: IC2.44 67.06,49.04 67.06,49.91 66.55,50.42 v66.29,50.42 | v25.4,39.37 SD-HEADER.2
  Bottom 0.152: v66.29,50.42 65.66,50.42 64.14,48.9 64.14,43.18 61.59,40.64 59.69,40.64 58.42,39.37 v25.4,39.37
SD-DI  (via drill 0.35)
  Top 0.152: IC2.1 63.31,47.18 62.23,48.26 62.23,50.8 v59.69,53.34 | v20.32,54.61 20.32,43.18 21.59,41.91 SD-HEADER.3
  Bottom 0.152: v59.69,53.34 56.77,56.26 30.1,56.26 29.46,56.9 25.15,56.9 24.51,56.26 21.08,56.26 20.32,55.5 v20.32,54.61
SD-DO  (via drill 0.35)
  Top 0.152: IC2.2 62.2,46.38 v61.47,47.12
  Bottom 0.152: v61.47,47.12 60.33,48.26 29.21,48.26 27.94,46.99 SD-HEADER.5
SD-SCK  (via drill 0.35)
  Top 0.152: IC2.3 61.35,45.58 v59.69,47.24
  Bottom 0.152: v59.69,47.24 59.18,47.75 29.97,47.75 26.67,44.45 SD-HEADER.4
STATUS-B  (via drill 0.35)
  Top 0.152: IC2.42 68.72,51.93 67.82,52.83 64.64,52.83 64.39,52.58 v64.39,50.7 | v20.32,40.64 19.05,40.64 13.97,35.56 LED5.A
  Bottom 0.152: v20.32,40.64 24.13,40.64 24.77,41.27 52.96,41.27 53.59,41.91 58.42,41.91 59.69,43.18 62.23,43.18 63.12,44.07 63.12,49.43 v64.39,50.7
STATUS-G  (via drill 0.35)
  Top 0.152: IC2.41 69.52,52.27 67.94,53.85 63.5,53.85 62.99,53.34 62.99,50.04 63.5,49.53 64.9,49.53 v65.53,48.9 | LED4.A 12.06,31.75 16.51,36.2 18.41,36.2 v20.32,38.1
  Bottom 0.152: v20.32,38.1 23.62,38.1 24.51,37.21 58.8,37.21 60.96,39.37 63.5,39.37 65.53,41.4 v65.53,48.9
STATUS-R  (via drill 0.35)
  Top 0.152: v69.98,53.34 70.32,53 IC2.40 | v19.05,48.26 17.78,46.99 17.78,43.18 13.97,39.37 LED3.A
  Bottom 0.152: v19.05,48.26 21.59,50.8 24.13,50.8 25.4,52.07 62.87,52.07 64.14,53.34 v69.98,53.34
VOLTMETER  (via drill 0.35)
  Top 0.152: R1.1 33.84,2.41 R2.2 42.23,4.13 44.45,6.35 44.45,11.43 46.99,13.97 52.07,13.97 53.34,15.24 53.34,17.78 v54.61,19.05 | v54.61,24.13 55.88,25.4 80.01,25.4 82.55,27.94 82.55,34.29 85.09,36.83 v85.09,39.75 | v85.09,45.72 84.45,46.35 80.64,46.35 79.5,45.21 78.36,45.21 77.93,44.78 IC2.30
  Bottom 0.152: v54.61,19.05 v54.61,24.13 | v85.09,39.75 v85.09,45.72
(copper drawn outside any net)
  shapes: Top area x2